# EAGLE design ESP32_Altherma (EAGLE 9.6.2)
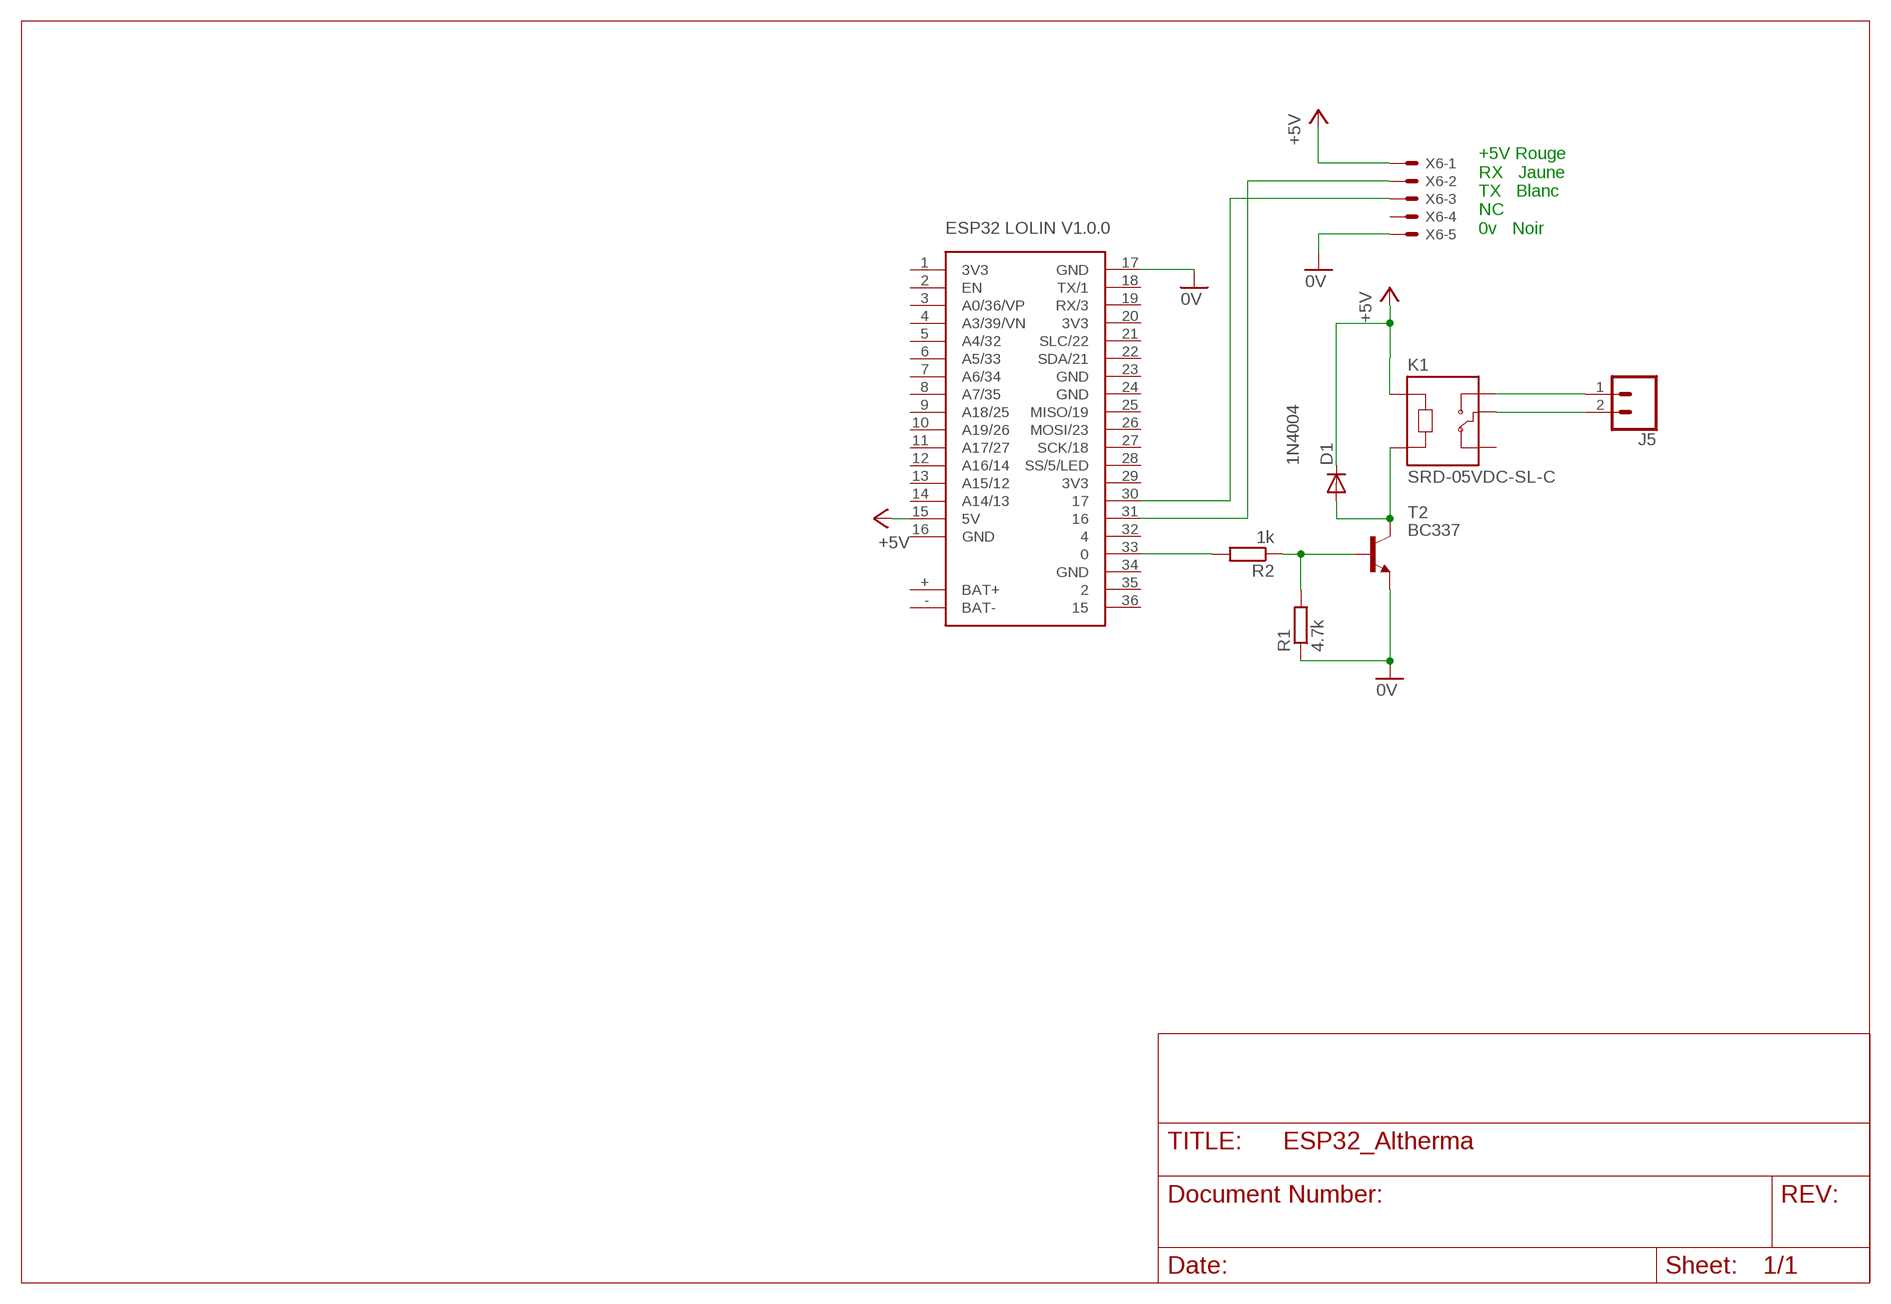
[diagram p0: schematic, sheet 1]

## Parts
D1  1N4004  [DO41-10]
J5  CONN_025MM  [BORNIER_A_VIS_2_5.12MM]
K1  SRD-05VDC-SL-C  [RELAY_SRD-05VDC-SL-C]
R1  4.7k  R-EU_0207/10  [0207/10]
R2  1k  R-EU_0207/10  [0207/10]
T2  BC337  [TO92]
U$4  ESP32_LOLIN_V1.0.0  [ESP32_LOLIN_V1.0.0]
X6  JST-XH-05-PIN-LONG-PAD  [JST-XH-05-PACKAGE-LONG-PAD]

## Nets
0V: R1.1 T2.1(E) U$4.17(GND) X6.5
+5V: D1.C K1.A1 U$4.15(5V) X6.1
N$1: D1.A K1.A2 T2.3(C)
N$2: U$4.31 X6.2
N$3: U$4.30 X6.3
N$4: J5.1 K1.NO
N$5: J5.2 K1.COM
N$7: R1.2 R2.1 T2.2(B)
N$10: R2.2 U$4.33
Unconnected: K1.NC U$4.2(EN) U$4.3(A0/36/VP) U$4.4(A3/39/VN) U$4.5(A4/32) U$4.6(A5/33) U$4.7(A6/34) U$4.8(A7/35) U$4.9(A18/25) U$4.10(A19/26) U$4.11(A17/27) U$4.12(A16/14) U$4.13(A15/12) U$4.14(A14/13) U$4.18(TX/1) U$4.19(RX/3) U$4.21(SLC/22) U$4.22(SDA/21) U$4.25(MISO/19) U$4.26(MOSI/23) U$4.27(SCK/18) U$4.28(SS/5/LED) U$4.32 U$4.35 U$4.36 X6.4

## Notes on the sheet
- +5V Rouge
  RX   Jaune
  TX   Blanc
  NC
  0v   Noir

## Power pins joined to a net without a drawn wire
3V3: U$4.1(3V3) U$4.20(3V3) U$4.29(3V3)
BAT+: U$4.+(BAT+)
BAT-: U$4.-(BAT-)
GND: U$4.16(GND) U$4.23(GND) U$4.24(GND) U$4.34(GND)

## Library data of the parts
D1 = adafruit:1N4004: DIODE General purpose 1N400x type rectifier (With bigger pads) http://www.ladyada.net/library/pcb/eaglelibrary.html
J5 = _Remy:CONN_02: Multi connection point. Often used as Generic Header-pin footprint for 0.1 inch spaced/style header connections On any of the 0.1 inch spaced packages, you can populate with these: Break Away Headers - Straight <https://www.sparkfun.com/products/116> (PRT-00116) Break Away Male Headers - Right Angle <https://www.sparkfun.com/products/553> (PRT-00553) Female Headers <https://www.sparkfun.com/products/115> (PRT-00115) Break Away Headers - Machine Pin <https://www.sparkfun.com/products/117> (PRT-00117) Break Away Female Headers - Swiss Machine Pin <https://www.sparkfun.com/products/743> (PRT-00743) For SCREWTERMINALS and SPRING TERMINALS visit here: Screw Terimnals on SparkFun.com <https://www.sparkfun.com/search/results?term=Screw+Terminals> (5mm/3.5mm/2.54mm spacing) This device is also useful as a general connection point to wire up your design to another part of your project. Our various solder wires solder well into these plated through hole pads. Hook-Up Wire - Assortment (Stranded, 22 AWG) <https://www.sparkfun.com/products/11375> (PRT-11375) Hook-Up Wire - Assortment (Solid Core, 22 AWG) <https://www.sparkfun.com/products/11367> (PRT-11367) View the entire wire category on our website here <https://www.sparkfun.com/categories/141> Special notes: Molex polarized connector foot print use with: PRT-08233 with associated crimp pins and housings. 2.54_SCREWTERM for use with PRT-10571. 3.5mm Screw Terminal footprints for PRT-08084 5mm Screw Terminal footprints for use with PRT-08432; SF_SKU: PRT-08432
K1 = SRD-05VDC-SL-C:SRD-05VDC-SL-C: 5V Trigger Relay Module For Arduino And Raspberry Pi 5V Trigger Relay Module For Arduino And Raspberry Pi; AVAILABILITY: Unavailable; DESCRIPTION: 5V Trigger Relay Module For Arduino And Raspberry Pi 5V Trigger Relay Module For Arduino And Raspberry Pi; MF: Songle Relay; MP: SRD-05VDC-SL-C; PACKAGE: None; PRICE: None
R1 R2 = 00-LIVIO:R-EU_: RESISTOR, European symbol
T2 = transistor:BC337: NPN TRANSISTOR
U$4 = _Remy:ESP32_LOLIN_V1.0.0
X6 = con-JST XH Connectors v1-0:JST-XH-05-PIN: JST XH Connector 2 Pin Wire to board connector. Pitch: 2,54 mm, (0.100") Number of pins: 5 Created by Rembrandt Electronics www.rembrandtelectronics.com

## Board
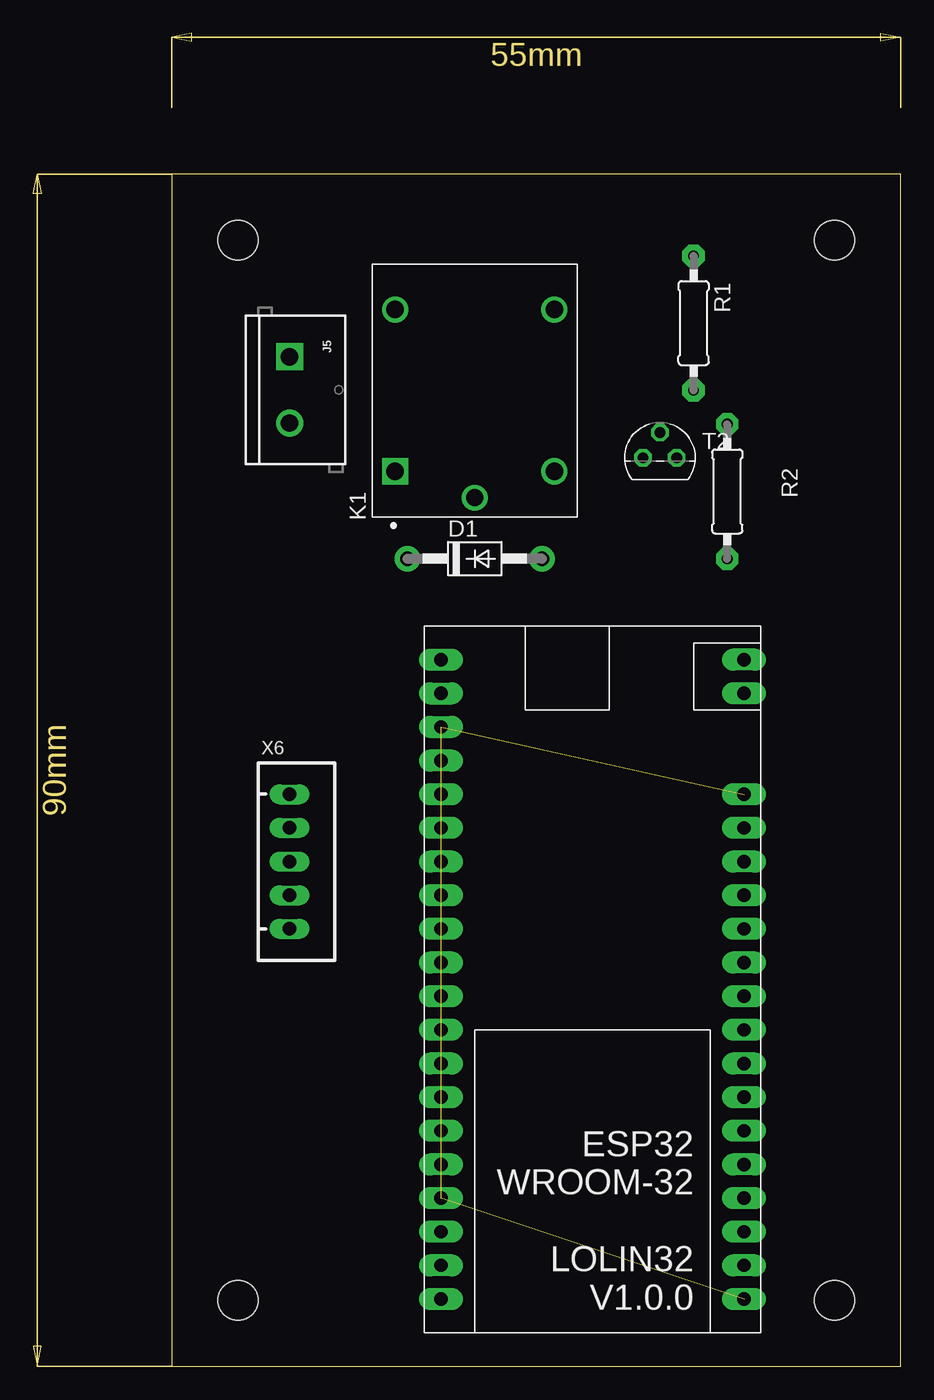
[diagram p1: board, top side]
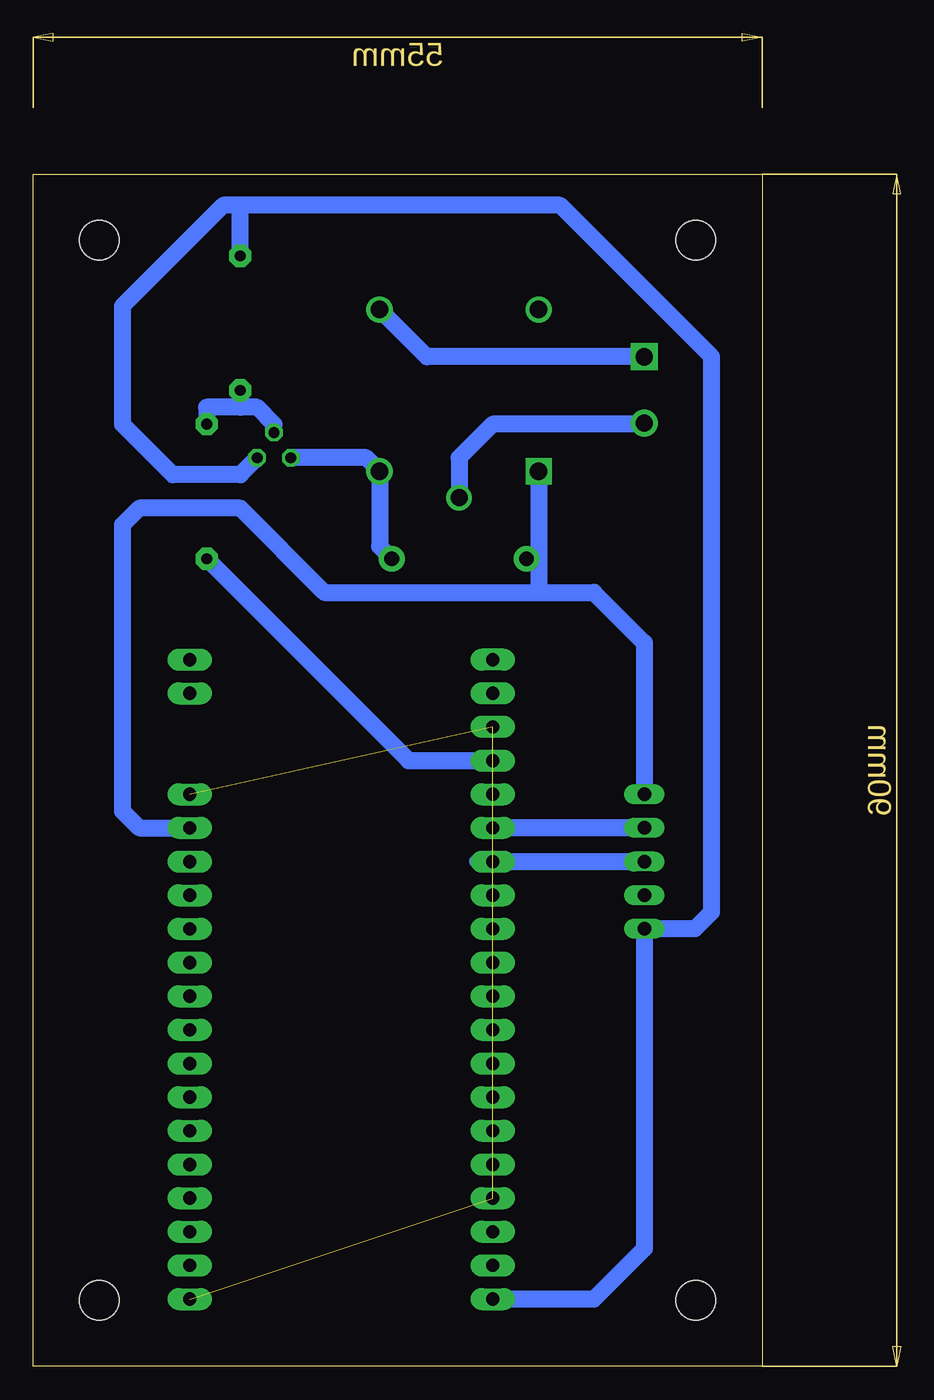
[diagram p2: board, bottom side, seen from below]

Size 55 x 90 mm. Coordinates in mm from the lower left corner, seen from the top.
Outline: 0,0 55,0 55,90 0,90 0,0
Copper layers (1*16): Top 0.035mm / dielectric 1.5mm / Bottom 0.035mm
Design rules "default": minimum track width 6mil, minimum drill 0.35mm, track to track 6mil, track to pad 6mil, pad to pad 6mil, via to via 6mil, smd to smd 6mil, copper to edge 40mil, drill to drill 6mil, minimum pad ring 10mil, minimum via ring 8mil, stop-mask expansion 4mil, vias tented up to drill 0mil, thermal gap 10mil
Holes 3 mm at 5,85 50,85 5,5 50,5

### Footprints (pad centres in the part's own frame; a part is rotated, then mirrored left to right if it is on the bottom)
DO41-10 = drill 1.118 pad 1.93: A 5.08,0; C -5.08,0
BORNIER_A_VIS_2_5.12MM = drill 1.3 pad 2.032 square: 1 -2.54,0 | drill 1.3 pad 2.032: 2 2.46,0
RELAY_SRD-05VDC-SL-C = drill 1.32 square: A1 -6.1,6 | drill 1.32: A2 -6.1,-6; NC 6.1,6; NO 6.1,-6 | drill 1.29: COM -8.1,0
0207/10 = drill 0.813 pad 1.676 octagon: 1 -5.08,0; 2 5.08,0
TO92 = drill 0.813 octagon: 1 1.27,0; 2 0,1.905; 3 -1.27,0
ESP32_LOLIN_V1.0.0 = drill 1 pad 1.676 long: 1 -11.43,24.13; 2 -11.43,21.59; 3 -11.43,19.05; 4 -11.43,16.51; 5 -11.43,13.97; 6 -11.43,11.43; 7 -11.43,8.89; 8 -11.43,6.35; 9 -11.43,3.81; 10 -11.43,1.27; 11 -11.43,-1.27; 12 -11.43,-3.81; 13 -11.43,-6.35; 14 -11.43,-8.89; 15 -11.43,-11.43; 16 -11.43,-13.97; 17 11.43,24.13; 18 11.43,21.59; 19 11.43,19.05; 20 11.43,16.51; 21 11.43,13.97; 22 11.43,11.43; 23 11.43,8.89; 24 11.43,6.35; 25 11.43,3.81; 26 11.43,1.27; 27 11.43,-1.27; 28 11.43,-3.81; 29 11.43,-6.35; 30 11.43,-8.89; 31 11.43,-11.43; 32 11.43,-13.97; 33 11.43,-16.51; 34 11.43,-19.05; 35 11.43,-21.59; 36 11.43,-24.13; + -11.43,-21.59; - -11.43,-24.13
JST-XH-05-PACKAGE-LONG-PAD = drill 1.016 long: 1 -5.08,0; 2 -2.54,0; 3 0,0; 4 2.54,0; 5 5.08,0

### Placement (x,y rotation side)
D1  22.86,60.96 0 top
J5  8.89,73.66 270 top
K1  22.86,73.66 90 top
R1  39.37,78.74 270 top
R2  41.91,66.04 270 top
T2  36.83,68.58 0 top
U$4  31.75,29.21 180 top
X6  8.89,38.1 270 top

### Tracks (layer width: path | path; a pad name or v marks a point on that pad's centre or on a via)
0V
  Bottom 1.27: U$4.17 12.7,5.08 8.89,8.89 X6.5 5.08,33.02 3.81,34.29 3.81,76.2 15.24,87.63 39.37,87.63 | 39.37,87.63 40.64,87.63 48.26,80.01 48.26,71.12 44.45,67.31 39.37,67.31 T2.1 | R1.1 39.37,87.63
3V3  (2 unrouted)
+5V
  Bottom 1.27: 16.51,58.42 33.02,58.42 39.37,64.77 46.99,64.77 48.26,63.5 48.26,41.91 46.99,40.64 U$4.15 | 16.51,58.42 12.7,58.42 8.89,54.61 X6.1 | K1.A1 16.86,60.96 | 16.86,60.96 16.86,58.77 16.51,58.42 | D1.C 16.86,60.96
GND  (3 unrouted)
N$1
  Bottom 1.27: D1.A 28.86,61.88 K1.A2 29.88,68.58 T2.3
N$2
  Bottom 1.27: X6.2 U$4.31
N$3
  Bottom 1.016: X6.3 21.59,38.1
  Bottom 1.27: U$4.30 X6.3
N$4
  Bottom 1.27: K1.NO 25.3,76.2 J5.1
N$5
  Bottom 1.27: J5.2 8.97,71.12 20.32,71.12 22.86,68.58 K1.COM
N$7
  Bottom 1.27: R2.1 41.91,72.39 39.37,72.39 | T2.2 36.83,71.12 38.1,72.39 39.37,72.39 | R1.2 39.37,72.39
N$10
  Bottom 1.27: R2.2 26.67,45.72 U$4.33